# Altium schematic sheet [02] MCU.SchDoc
size A4
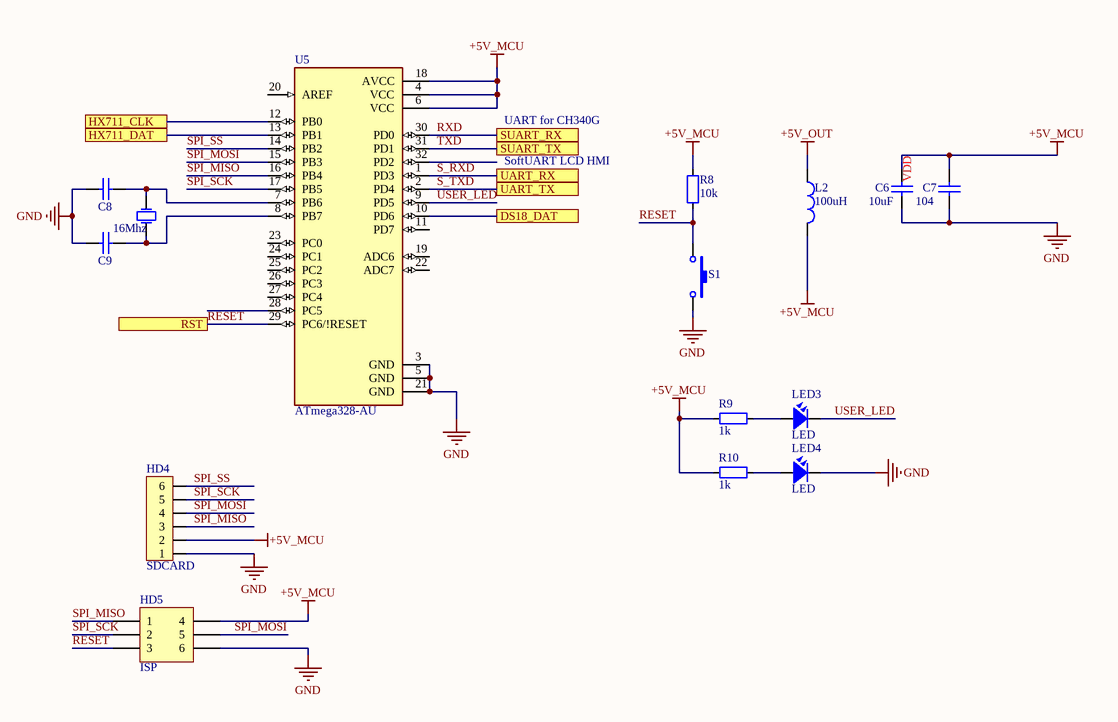
[diagram p0: [02] MCU.SchDoc]

## Parts
C6  10uF  [CAP_0805]
C7  104  [CAP_0805]
C8  Capacitor Ceramic  [CAP_0805]  (value not drawn)
C9  Capacitor Ceramic  [CAP_0805]  (value not drawn)
HD4  SDCARD  [CON_6P]
HD5  ISP  [HDR2X3_CEN]
L2  100uH  [RES-SMD-0805]
LED3  LED  [LED-0805-Red]
LED4  LED  [LED-0805-Red]
R8  10k  [RES-SMD-0805]
R9  1k  [RES-SMD-0805]
R10  1k  [RES-SMD-0805]
S1  SW-SMD  [SW-SMD]  (value not drawn)
U5  ATmega328-AU  [TQFP 32]
Y1  16Mhz  [XTAL]

## Ports
DS18_DAT, HX711_CLK, HX711_DAT, RST, SUART_RX, SUART_TX, UART_RX, UART_TX

## Nets
+5V_MCU: C6.2 C7.2 HD4.2 HD5.4 L2.2 R8.1 R9.1 R10.1 U5.4(VCC) U5.6(VCC) U5.18(AVCC)
+5V_OUT: L2.1
GND: C6.1 C7.1 C8.1 C9.1 HD4.1 HD5.6 LED4.2 S1.2 U5.3(GND) U5.5(GND) U5.21(GND)
DS18_DAT: U5.10(PD6) ; port DS18_DAT
HX711_CLK: U5.12(PB0) ; port HX711_CLK
HX711_DAT: U5.13(PB1) ; port HX711_DAT
RESET: HD5.3 R8.2 S1.1 U5.29(PC6/!RESET) ; port RST
RXD: U5.30(PD0) ; port SUART_RX
S_RXD: U5.1(PD3) ; port UART_RX
S_TXD: U5.2(PD4) ; port UART_TX
SPI_MISO: HD4.3 HD5.1 U5.16(PB4)
SPI_MOSI: HD4.4 HD5.5 U5.15(PB3)
SPI_SCK: HD4.5 HD5.2 U5.17(PB5)
SPI_SS: HD4.6 U5.14(PB2)
TXD: U5.31(PD1) ; port SUART_TX
USER_LED: LED3.2 U5.9(PD5)
NetC8_2: C8.2 U5.7(PB6) Y1.2(OSC2)
NetC9_2: C9.2 U5.8(PB7) Y1.1(OSC1)
NetLED3_1: LED3.1 R9.2
NetLED4_1: LED4.1 R10.2

Not connected (* = marked no-connect by the designer): U5 11(PD7) 19(ADC6) 20(AREF) 22(ADC7) 23(PC0) 24(PC1) 25(PC2) 26(PC3) 27(PC4) 28(PC5) 32(PD2)

## Notes on the sheet
- UART for CH340G
- SoftUART LCD HMI
- (near C6) VDD

## Library data of the parts
C6-C9 = CapSMD: Capacitor; Value: 33p; Published: 8-Jun-2000; LatestRevisionDate: 17-Jul-2002; LatestRevisionNote: Re-released for DXP Platform.; PackageReference: RAD-0.3; Publisher: Altium Limited
HD4 = Header6: Header IDC, 6 x 1 Pin Vertical 2.54mm Pitch (Non-Boxed, Male); Manufacturer: W¨¹rth Elektronik eiSos GmbH; partNo: 613002143121; ComponentLink1 Description: Manufacturer; ComponentLink2 Description: Datasheet; NoPins: 02; Created Date: 29 March 2013; ComponentLink1URL: http://www.we-online.com; ComponentLink2URL: http://katalog.we-online.de/em/datasheet/6130xx143121.pdf; Created by: Karrer Zheng
HD5 = Header 3X2A: Header, 3-Pin, Dual row; LatestRevisionDate: 17-Jul-2002; LatestRevisionNote: Re-released for DXP Platform.; Publisher: Altium Limited
L2 = Inductor: Value: 150 mH
LED3 LED4 = LED: LED Single colour Green and Red; Value: LED 3 ly Single Colour
R8-R10 = Resistor - SMD: Resistor; Manufacturer: Generic Components; Class: Passive; Published: 08/06/2000; Publisher: Altium Hobart Technology Centre
S1 = SW-SMD: Switch; Published: 24-Mar-1999; LatestRevisionDate: 17-Jul-2002; LatestRevisionNote: Re-released for DXP Platform.; PackageReference: SPST-2; Publisher: Altium Limited
U5 = ATmega328-AU: 8-bit AVR Microcontroller, 32KB Flash, 1KB EEPROM, 2KB SRAM, 32-pin TQFP, Industrial Grade (-40°C to 85°C); Published: 1-Apr-2010; DatasheetVersion: revA, Jan-2010; PackageVersion: revB, Oct-2001; PackageReference: 32A; Publisher: Altium Limited; PackageDescription: 32-Lead, 7x7x1.0 mm Body, 0.8mm Lead Pitch, Thin Profile Plastic Quad Flat Package (TQFP); Code_JEDEC: MS-026-ABA
Y1 = XTAL: Crystal Oscillator; Published: 8-Jun-2000; LatestRevisionDate: 17-Jul-2002; LatestRevisionNote: Re-released for DXP Platform.; PackageReference: R38; Publisher: Altium Limited